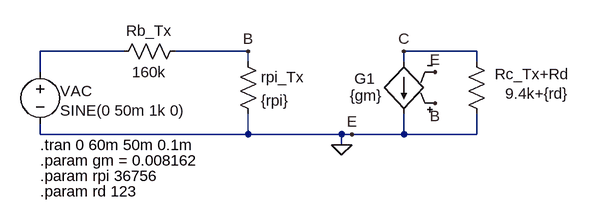
[diagram p0: schematic elec310_proj_ACTx.asc]
elec310_proj_ACTx.asc, the LTspice schematic file:
Version 4
SHEET 1 1640 680
WIRE 752 48 624 48
WIRE 944 48 832 48
WIRE 1296 48 1184 48
WIRE 944 64 944 48
WIRE 1184 64 1184 48
WIRE 1296 64 1296 48
WIRE 624 80 624 48
WIRE 624 176 624 160
WIRE 944 176 944 144
WIRE 944 176 624 176
WIRE 1088 176 944 176
WIRE 1104 176 1088 176
WIRE 1184 176 1184 144
WIRE 1184 176 1104 176
WIRE 1296 176 1296 144
WIRE 1296 176 1184 176
WIRE 1088 192 1088 176
FLAG 1088 192 0
FLAG 944 48 B
FLAG 1184 48 C
FLAG 1104 176 E
FLAG 1232 128 B
FLAG 1232 80 E
SYMBOL res 736 64 R270
WINDOW 0 32 56 VTop 2
WINDOW 3 0 56 VBottom 2
SYMATTR InstName Rb_Tx
SYMATTR Value 160k
SYMBOL voltage 624 64 R0
WINDOW 123 0 0 Left 0
WINDOW 39 0 0 Left 0
WINDOW 0 31 45 Left 2
WINDOW 3 31 75 Left 2
SYMATTR InstName VAC
SYMATTR Value SINE(0 50m 1k 0)
SYMBOL res 928 48 R0
SYMATTR InstName rpi_Tx
SYMATTR Value {rpi}
SYMBOL res 1312 160 R180
WINDOW 0 -127 77 Left 2
WINDOW 3 -126 47 Left 2
SYMATTR InstName Rc_Tx+Rd
SYMATTR Value 9.4k+{rd}
SYMBOL g 1184 160 R180
WINDOW 0 44 70 Left 2
WINDOW 3 33 44 Left 2
SYMATTR InstName G1
SYMATTR Value {gm}
TEXT 624 192 Left 2 !.tran 0 60m 50m 0.1m
TEXT 624 216 Left 2 !.param gm = 0.008162
TEXT 624 240 Left 2 !.param rpi 36756
TEXT 624 264 Left 2 !.param rd 123

The netlist it stands for:
* elec310_proj_ACTx.asc
Rb_Tx N001 B 160k
VAC N001 0 SINE(0 50m 1k 0)
rpi_Tx B 0 {rpi}
Rc_Tx+Rd 0 C 9.4k+{rd}
G1 C 0 B 0 {gm}
.tran 0 60m 50m 0.1m
.param gm = 0.008162
.param rpi 36756
.param rd 123
.backanno
.end